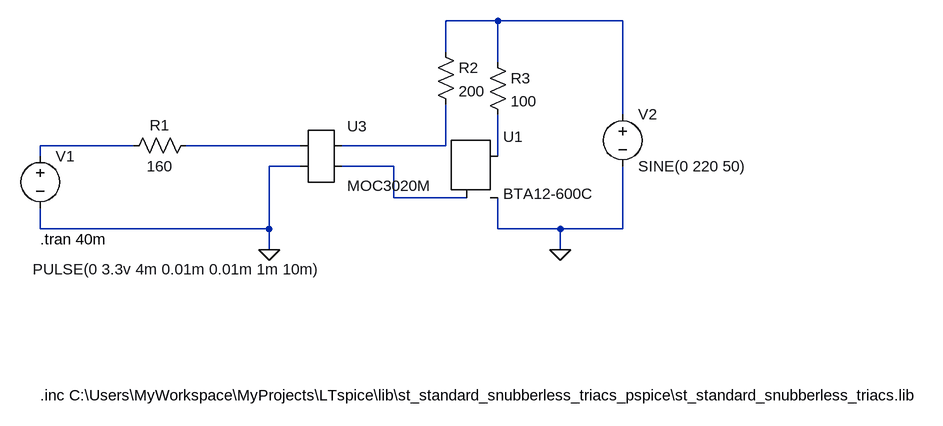
[diagram p0: schematic dimmer.asc]
dimmer.asc, the LTspice schematic file:
Version 4
SHEET 1 1156 680
WIRE 336 -96 256 -96
WIRE 528 -96 336 -96
WIRE 256 -48 256 -96
WIRE 336 -32 336 -96
WIRE 528 48 528 -96
WIRE -224 96 -368 96
WIRE 32 96 -144 96
WIRE 256 96 256 32
WIRE 256 96 96 96
WIRE -368 112 -368 96
WIRE 336 112 336 48
WIRE 32 128 -16 128
WIRE 176 128 96 128
WIRE 176 176 176 128
WIRE 288 176 176 176
WIRE -368 224 -368 192
WIRE -16 224 -16 128
WIRE -16 224 -368 224
WIRE 336 224 336 176
WIRE 432 224 336 224
WIRE 528 224 528 128
WIRE 528 224 432 224
WIRE -16 256 -16 224
WIRE 432 256 432 224
FLAG -16 256 0
FLAG 432 256 0
SYMBOL Misc\\TRIAC 304 112 R0
SYMATTR InstName U1
SYMATTR Value BTA12-600C
SYMBOL res -128 80 R90
WINDOW 0 0 56 VBottom 2
WINDOW 3 32 56 VTop 2
SYMATTR InstName R1
SYMATTR Value 160
SYMBOL res 240 -64 R0
SYMATTR InstName R2
SYMATTR Value 200
SYMBOL voltage -368 96 R0
WINDOW 123 0 0 Left 0
WINDOW 39 0 0 Left 0
WINDOW 3 -12 190 Left 2
SYMATTR InstName V1
SYMATTR Value PULSE(0 3.3v 4m 0.01m 0.01m 1m 10m)
SYMBOL res 320 -48 R0
SYMATTR InstName R3
SYMATTR Value 100
SYMBOL voltage 528 32 R0
WINDOW 123 0 0 Left 0
WINDOW 39 0 0 Left 0
SYMATTR InstName V2
SYMATTR Value SINE(0 220 50)
SYMBOL AutoGenerated\\MOC3020M 64 112 R0
SYMATTR InstName U3
TEXT -368 240 Left 2 !.tran 40m
TEXT -368 480 Left 2 !.inc C:\\Users\\MyWorkspace\\MyProjects\\LTspice\\lib\\st_standard_snubberless_triacs_pspice\\st_standard_snubberless_triacs.lib

The netlist it stands for:
* dimmer.asc
XU1 N005 N006 0 BTA12-600C  ; pins MT2 G MT1
R1 N003 N002 160
R2 N001 N004 200
V1 N002 0 PULSE(0 3.3v 4m 0.01m 0.01m 1m 10m)
R3 N001 N005 100
V2 N001 0 SINE(0 220 50)
* U3: MOC3020M (symbol AutoGenerated\MOC3020M not available, pins judged from their places): pin1=N003 pin2=0 pin3=N004 pin4=N006
.tran 40m
.inc C:\Users\MyWorkspace\MyProjects\LTspice\lib\st_standard_snubberless_triacs_pspice\st_standard_snubberless_triacs.lib
.backanno
.end